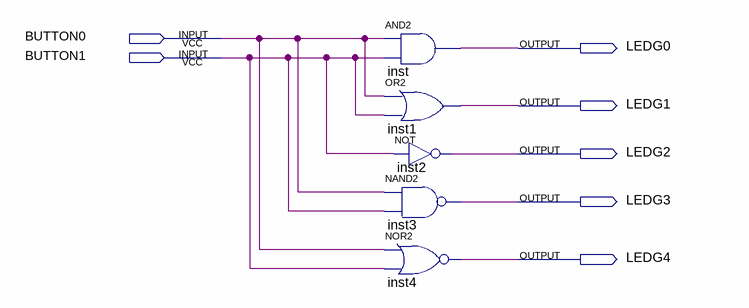
[diagram p0: schematic sheet]
// Quartus schematic Lab1.bdf as structural Verilog: 5 symbols, 7 pins
module Lab1 (
  input  BUTTON0,
  input  BUTTON1,
  output LEDG0,
  output LEDG1,
  output LEDG2,
  output LEDG3,
  output LEDG4
);

  and inst (LEDG0, BUTTON0, BUTTON1);
  or inst1 (LEDG1, BUTTON0, BUTTON1);
  not inst2 (LEDG2, BUTTON1);
  nand inst3 (LEDG3, BUTTON0, BUTTON1);
  nor inst4 (LEDG4, BUTTON0, BUTTON1);
endmodule
